# EasyEDA Pro project ProDoc_Sensor_2025-09-14.epro, schematic SS
Board Name: Sensor; Create Date: 2025-09-01; Page Name: P1; Project Name: ICM module; Schematic Name: Schematic3; Update Date: 2025-09-03; Company: EasyEDA.com; Page Size: A4; Version: V1.0
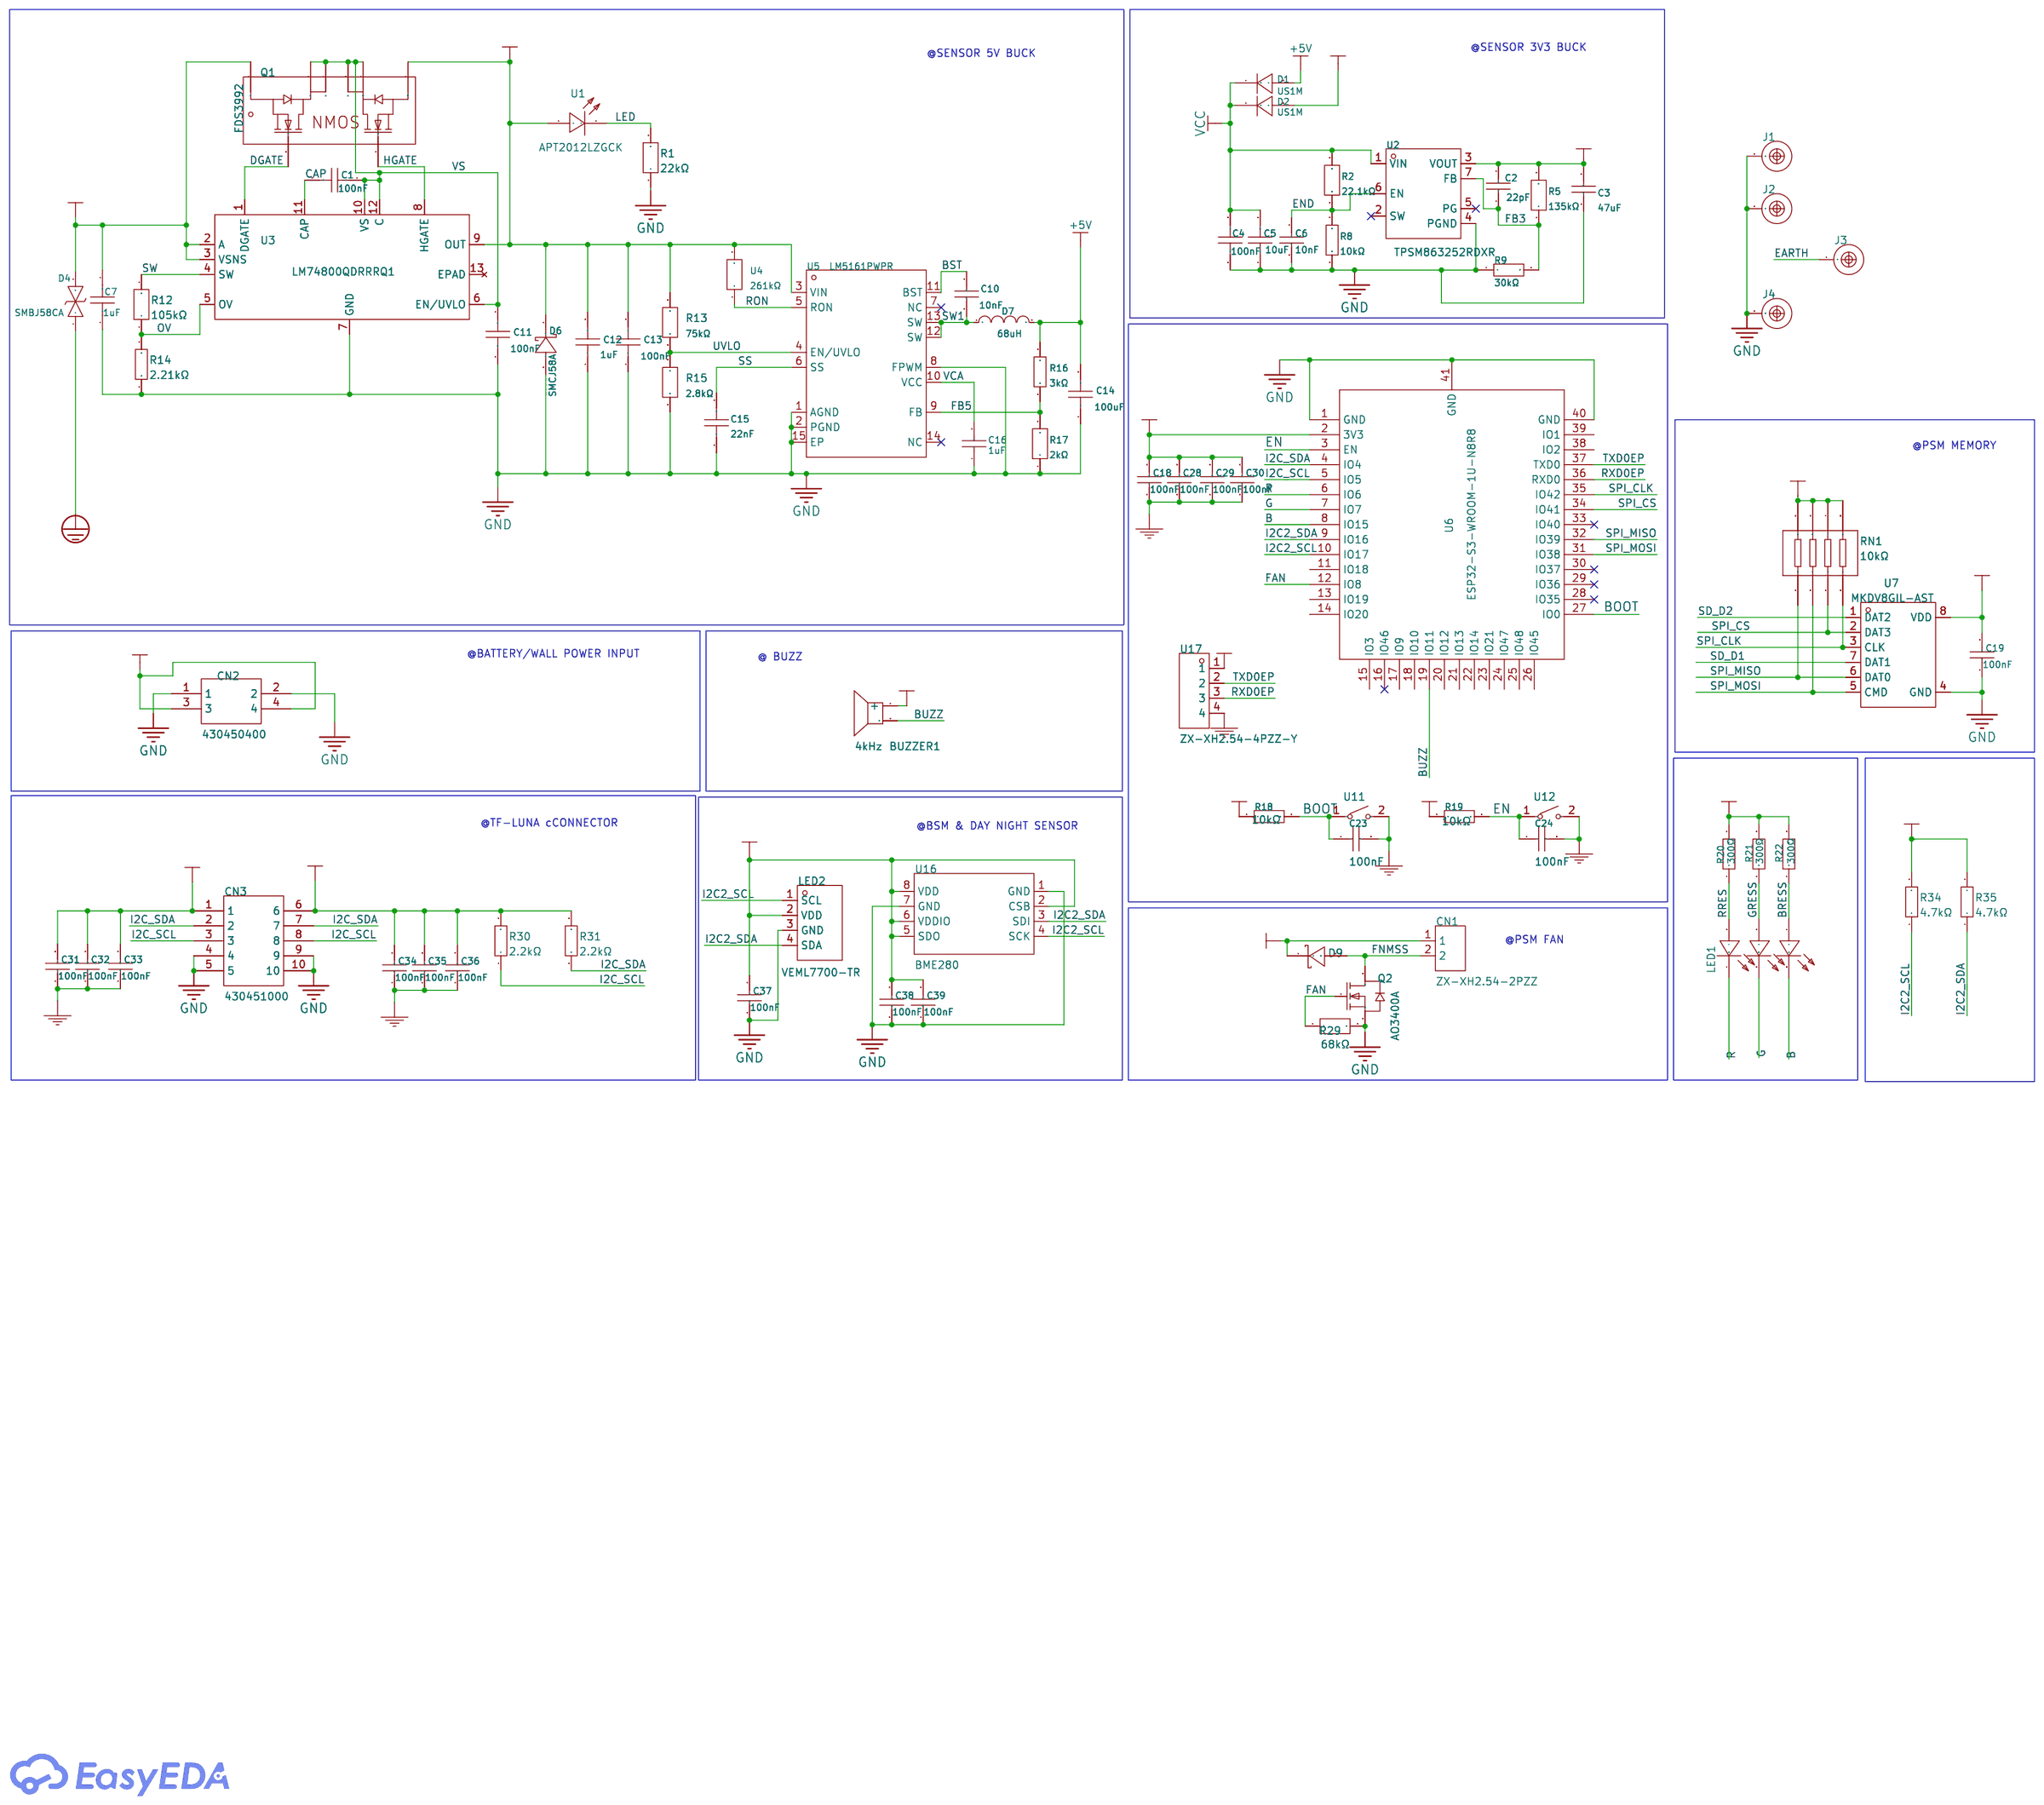
[diagram p0: schematic sheet]

## Parts
BUZZER1  4kHz  [BUZ-TH_PKM13EPYH4002-B0]
C1  100nF  [C1210]
C2  22pF  [C0201]
C3  47uF  [C1210]
C4  100nF  [C0402]
C5  10uF  [C0805]
C6  10nF  [C0201]
C7  1uF  [C2220]
C10  10nF  [C0402]
C11  100nF  [C1210]
C12  1uF  [C2220]
C13  100nF  [C1210]
C14  100uF  [C1210]
C15  22nF  [C0805]
C16  1uF  [C0603]
C18  100nF  [C0805]
C19  100nF  [C0805]
C23  100nF  [C0805]
C24  100nF  [C0805]
C28  100nF  [C0805]
C29  100nF  [C0805]
C30  100nF  [C0805]
C31  100nF  [C0805]
C32  100nF  [C0805]
C33  100nF  [C0805]
C34  100nF  [C0805]
C35  100nF  [C0805]
C36  100nF  [C0805]
C37  100nF  [C0805]
C38  100nF  [C0805]
C39  100nF  [C0805]
CN1  ZX-XH2.54-2PZZ  [CONN-TH_2P-P2.50_HX25003-2A]
CN2  430450400  [CONN-TH_0430450400]
CN3  430451000  [CONN-TH_43045-1000]
D1  US1M  [SMA_L4.4-W2.8-LS5.4-RD]
D2  US1M  [SMA_L4.4-W2.8-LS5.4-RD]
D4  SMBJ58CA  [SMB_L4.6-W3.6-LS5.3-BI]
D6  SMCJ58A  [SMC_L6.9-W5.8-LS7.9-RD]
D7  68uH  [IND-SMD_L12.5-W12.5-SRR1280-150M]
D9  BAT46WJ,115  [SOD-323F_L2.0-W1.6-LS2.5-RD]
J1  SCREW-MOUNTING-HOLE-3MM  [MountingHole:MountingHole_2.7mm_M2.5_Pad_Via]
J2  SCREW-MOUNTING-HOLE-3MM  [MountingHole:MountingHole_2.7mm_M2.5_Pad_Via]
J3  SCREW-MOUNTING-HOLE-3MM  [MountingHole:MountingHole_2.7mm_M2.5_Pad_Via]
J4  SCREW-MOUNTING-HOLE-3MM  [MountingHole:MountingHole_2.7mm_M2.5_Pad_Via]
LED1  HL-AF-5060H271BU46FU79GC-S1-THL  [LED-ARRAY-SMD_6P-L5.4-W5.0-TL-FD]
LED2  VEML7700-TR  [LED-SMD_4P-L6.8-W2.4_VEML7700-TR]
Q1  FDS3992  [SO-8_L4.9-W3.9-P1.27-LS5.9-BL]
Q2  AO3400A  [SOT-23-3_L2.9-W1.6-P1.90-LS2.8-BR]
R1  22kΩ  [R1210]
R2  22.1kΩ  [R0402]
R5  135kΩ  [R0603]
R8  10kΩ  [R0402]
R9  30kΩ  [R0603]
R12  105kΩ  [R1206]
R13  75kΩ  [R1210]
R14  2.21kΩ  [R1206]
R15  2.8kΩ  [R1210]
R16  3kΩ  [R0603]
R17  2kΩ  [R0402]
R18  10kΩ  [R0805]
R19  10kΩ  [R0805]
R20  300Ω  [R0805]
R21  300Ω  [R0805]
R22  300Ω  [R0805]
R29  68kΩ  [R1206]
R30  2.2kΩ  [R0805]
R31  2.2kΩ  [R0805]
R34  4.7kΩ  [R0805]
R35  4.7kΩ  [R0805]
RN1  10kΩ  [RES-ARRAY-SMD_0603-8P-L3.2-W1.6-BL]
U1  APT2012LZGCK  [LED-SMD_L2.0-W1.3-R-RD]
U2  TPSM863252RDXR  [QFN-7_L4.0-W3.3_TPSM863257RDXR]
U3  LM74800QDRRRQ1  [WSON-12_L3.0-W3.0-P0.50-TL-EP-2]
U4  261kΩ  [R0402]
U5  LM5161PWPR  [HTSSOP-14_L5.0-W4.4-P0.65-LS6.4-BL-EP3.0]
U6  ESP32-S3-WROOM-1U-N8R8  [WIRELM-SMD_ESP32-S3-WROOM-1U]
U7  MKDV8GIL-AST  [LGA-8_L6.0-W8.0-P1.27-TL]
U11  TD-1183SN-1.7H-250  [KEY-SMD_L3.0-W2.5-LS4.0]
U12  TD-1183SN-1.7H-250  [KEY-SMD_L3.0-W2.5-LS4.0]
U16  BME280  [LGA-8_BME280_BL]
U17  ZX-XH2.54-4PZZ-Y  [CONN-TH_4P-P2.50_ZX-XH2.54-4PZZ-Y]

## Library data of the parts
BUZZER1 = PKM13EPYH4002-B0: Driver Circuitry:Passive (external drive) Technology:Piezoelectric Voltage Rating:- Voltage - Supply:±15V Voltage - Supply:±15V Frequency:4kHz Current Consumption:- Sound Pressure Level(SPL):78dB Diameter(φD):12.6mm Length:- Width:- Height:7.4mm Operating; LCSC Part Name: 压电式蜂鸣器; Supplier Part: C128650; Manufacturer: muRata(村田); Supplier Footprint: 插件,D=12.6mm; JLCPCB Part Class: Extended Part; Datasheet: https://atta.szlcsc.com/upload/public/pdf/source/20200305/C492053_735FBBD713E87D0F645D81009B709975.pdf; Supplier: LCSC; Driver Circuitry: Passive (external drive); Technology: Piezoelectric; Voltage - Supply: ±15V; Sound Pressure Level(SPL): 78dB; Diameter(φD): 12.6mm; Height: 7.4mm; Operating Temperature: -40℃~+85℃
C1 C11 C13 = CC1210KKX7RYBB104: Capacitance: Tolerance:±10% Tolerance:±10% Voltage Rated: Temperature Coefficient:; LCSC Part Name: 100nF ±10% 250V; Supplier Part: C527381; Manufacturer: YAGEO(国巨); Supplier Footprint: 1210; JLCPCB Part Class: Extended Part; Datasheet: https://atta.szlcsc.com/upload/public/pdf/source/20200508/C527381_FB64CFF56C74B71B8CBBB2E2D2FF56B0.pdf; Supplier: LCSC; Tolerance: ±10%
C2 = GRM0335C1E220JA01D: Capacitance: Tolerance:±5% Tolerance:±5% Voltage Rated: Temperature Coefficient:; LCSC Part Name: 22pF ±5% 25V; Supplier Part: C76919; Manufacturer: muRata(村田); Supplier Footprint: 0201; JLCPCB Part Class: Extended Part; Datasheet: https://atta.szlcsc.com/upload/public/pdf/source/20180307/C76919_15204090858141407709.pdf; Supplier: LCSC; Tolerance: ±5%
C3 = GRM32ER71A476KE15L: Capacitance: Tolerance:±10% Tolerance:±10% Voltage Rated: Temperature Coefficient:; LCSC Part Name: 47uF ±10% 10V; Supplier Part: C84494; Manufacturer: muRata(村田); Supplier Footprint: 1210; JLCPCB Part Class: Extended Part; Datasheet: https://atta.szlcsc.com/upload/public/pdf/source/20161226/1482720144456.pdf; Supplier: LCSC; Tolerance: ±10%
C4 = GRM155R71A104KA01D: Capacitance: Tolerance:±10% Tolerance:±10% Voltage Rated: Temperature Coefficient:; LCSC Part Name: 100nF ±10% 10V; Supplier Part: C71687; Manufacturer: muRata(村田); Supplier Footprint: 0402; JLCPCB Part Class: Extended Part; Datasheet: https://atta.szlcsc.com/upload/public/pdf/source/20180228/C71687_15198055953951377607.pdf; Supplier: LCSC; Tolerance: ±10%
C5 = C0805C106K8PACTU: Capacitance: Tolerance:±10% Tolerance:±10% Voltage Rated: Temperature Coefficient:; LCSC Part Name: 10uF ±10% 10V; Supplier Part: C2167673; Manufacturer: KEMET(基美); Supplier Footprint: 0805; JLCPCB Part Class: Extended Part; Datasheet: https://atta.szlcsc.com/upload/public/pdf/source/20210601/F69F25D6FEA5EB3D7C122B835EA50B80.pdf; Supplier: LCSC; Tolerance: ±10%
C6 = GRM033R70J103KA01D: Capacitance: Tolerance:±10% Tolerance:±10% Voltage Rated: Temperature Coefficient:; LCSC Part Name: 10nF ±10% 6.3V; Supplier Part: C76940; Manufacturer: muRata(村田); Supplier Footprint: 0201; JLCPCB Part Class: Extended Part; Datasheet: https://atta.szlcsc.com/upload/public/pdf/source/20180307/C76940_15204091030811407728.pdf; Supplier: LCSC; Tolerance: ±10%
C7 C12 = GRM55DR72E105KW01L: Capacitance: Tolerance:±10% Tolerance:±10% Voltage Rated: Temperature Coefficient:; LCSC Part Name: 1uF ±10% 250V; Supplier Part: C489791; Manufacturer: muRata(村田); Supplier Footprint: 2220; JLCPCB Part Class: Extended Part; Datasheet: https://atta.szlcsc.com/upload/public/pdf/source/20200303/C489791_21819A01F8644F985297DAC22D62BF33.pdf; Supplier: LCSC; Tolerance: ±10%
C10 = GRM155R71H103KA88D: Capacitance: Tolerance:±10% Tolerance:±10% Voltage Rated: Temperature Coefficient:; LCSC Part Name: 10nF ±10% 50V; Supplier Part: C77019; Manufacturer: muRata(村田); Supplier Footprint: 0402; JLCPCB Part Class: Extended Part; Datasheet: https://atta.szlcsc.com/upload/public/pdf/source/20180326/C77019_6A3693CE1BCE757D6A8B7C99DAE1B441.pdf; Supplier: LCSC; Tolerance: ±10%
C14 = GRM32ER60J107ME20L_C88154: Capacitance: Tolerance:±20% Tolerance:±20% Voltage Rated: Temperature Coefficient:; LCSC Part Name: 100uF ±20% 6.3V; Supplier Part: C88154; Manufacturer: muRata(村田); Manufacturer Part: GRM32ER60J107ME20L; Supplier Footprint: 1210; JLCPCB Part Class: Extended Part; Datasheet: https://atta.szlcsc.com/upload/public/pdf/source/20170116/1484561244372.pdf; Supplier: LCSC; Tolerance: ±20%
C15 = CC0805KRX7R7BB223: Capacitance: Tolerance:±10% Tolerance:±10% Voltage Rated: Temperature Coefficient:; LCSC Part Name: 22nF ±10% 16V; Supplier Part: C519961; Manufacturer: YAGEO(国巨); Supplier Footprint: 0805; JLCPCB Part Class: Extended Part; Datasheet: https://atta.szlcsc.com/upload/public/pdf/source/20200423/C519961_BCF55CFF7AF7FA8FAC393D5C8451BEF7.pdf; Supplier: LCSC; Tolerance: ±10%
C16 = EMK107B7105KA-T: Capacitance:1uF Tolerance:±10% Tolerance:±10% Voltage Rating:16V Temperature Coefficient:X7R; LCSC Part Name: MSASE168SB7105KTNA01 1uF ±10% 16V; Supplier Part: C92759; Manufacturer: TAIYO YUDEN(太诱); Supplier Footprint: 0603; JLCPCB Part Class: Extended Part; Datasheet: https://item.szlcsc.com/datasheet/EMK107B7105KA-T/93953.html; Supplier: LCSC; Tolerance: ±10%; Voltage Rating: 16V; Temperature Coefficient: X7R
C18 C19 C23 C24 C28-C39 = 0805B104K500NT: Capacitance:100nF Tolerance:±10% Tolerance:±10% Voltage Rated: Temperature Coefficient:; LCSC Part Name: 100nF ±10% 50V; Supplier Part: C38141; Manufacturer: FH(风华); Supplier Footprint: 0805; JLCPCB Part Class: Extended Part; Datasheet: https://atta.szlcsc.com/upload/public/pdf/source/20200305/C486355_26A10D38EF8C2A5C37091D0039909270.pdf; Supplier: LCSC; Tolerance: ±10%
CN1 = ZX-XH2.54-2PZZ: Pins Structure:1x2P Pitch:2.5mm Mounting Type:Through Hole Reference Series:XH Number of Pins:2P Number of Rows:1 Number of PINs Per Row:2 Row Spacing:- Current Rating:3A Contact Material:Brass Contact Plating:Tin Operating Temperature:-25℃~+85℃ Operating; LCSC Part Name: 1x2P 间距:2.5mm 直插 系列:XH; Supplier Part: C7429632; Manufacturer: Megastar(兆星); Supplier Footprint: 插件,P=2.5mm; JLCPCB Part Class: Extended Part; Datasheet: https://item.szlcsc.com/datasheet/ZX-XH2.54-2PZZ/8427549.html; Supplier: LCSC; Pins Structure: 1x2P; Pitch: 2.5mm; Mounting Type: Through Hole; Reference Series: XH; Number of Pins: 2P; Number of Rows: 1; Number of PINs Per Row: 2; Current Rating: 3A; Contact Material: Brass; Contact Plating: Tin; Operating Temperature: -25℃~+85℃; Voltage Rating: 250V; Plastic Material: PA66; Flame Retardant Rating: UL94V-0; Color: White; Z-Height of the Board: 7mm; X-Length of Bottom Edge on Board (Spacing Line): 7.5mm; Y-Width of Bottom Edge on Board: 5.9mm
CN2 = 430450400_C122413: Pins Structure:2x2P Pitch:3mm Mounting Type:Right Angle Reference Series:Micro-Fit(MX 3.0) Number of Pins:4P Number of Rows:2 Number of PINs Per Row:2 Row Spacing:3mm Current Rating:8.5A Contact Material:Brass Contact Plating:Tin Operating Temperature:-40; LCSC Part Name: 2x2P 间距:3mm 弯插 系列:Micro-Fit(MX 3.0); Supplier Part: C122413; Manufacturer: MOLEX; Supplier Footprint: 弯插,P=3mm; JLCPCB Part Class: Extended Part; Datasheet: https://www.molex.com/content/dam/molex/molex-dot-com/products/automated/en-us/salesdrawingpdf/430/43045/430450400_sd.pdf?inline\; Supplier: LCSC; Pins Structure: 2x2P; Pitch: 3mm; Mounting Type: Right Angle; Reference Series: Micro-Fit(MX 3.0); Number of Pins: 4P; Number of Rows: 2; Number of PINs Per Row: 2; Row Spacing: 3mm; Current Rating: 8.5A; Contact Material: Brass; Contact Plating: Tin; Operating Temperature: -40℃~+105℃; Voltage Rating: 600V; Flame Retardant Rating: UL94V-0; Supplementary Features: Harpoon Contact (Plastic); Color: Black; Z-Height of the Board: 8.77mm; X-Length of Bottom Edge on Board (Spacing Line): 9.65mm; Y-Width of Bottom Edge on Board: 12.24mm
CN3 = 430451000: Pins Structure:2x5P Pitch:3mm Mounting Type:Right Angle Reference Series:Micro-Fit(MX 3.0) Number of Pins:10P Number of Rows:2 Number of PINs Per Row:5 Row Spacing:3mm Current Rating:8.5A Contact Material:Brass Contact Plating:Tin Operating Temperature:-4; LCSC Part Name: 2x5P 间距:3mm 弯插 系列:Micro-Fit(MX 3.0); Supplier Part: C122421; Manufacturer: MOLEX; Supplier Footprint: 弯插,P=3mm; JLCPCB Part Class: Extended Part; Datasheet: https://www.molex.com/content/dam/molex/molex-dot-com/products/automated/en-us/salesdrawingpdf/430/43045/430451000_sd.pdf?inline\; Supplier: LCSC; Pins Structure: 2x5P; Pitch: 3mm; Mounting Type: Right Angle; Reference Series: Micro-Fit(MX 3.0); Number of Pins: 10P; Number of Rows: 2; Number of PINs Per Row: 5; Row Spacing: 3mm; Current Rating: 8.5A; Contact Material: Brass; Contact Plating: Tin; Operating Temperature: -40℃~+105℃; Voltage Rating: 600V; Flame Retardant Rating: UL94V-0; Supplementary Features: Harpoon Contact (Plastic); Color: Black; Z-Height of the Board: 8.77mm; X-Length of Bottom Edge on Board (Spacing Line): 18.65mm; Y-Width of Bottom Edge on Board: 12.24mm
D1 D2 = US1M_C412437: Diode Configuration:Independent Type Forward Voltage (Vf@If):1.65V@1A Reverse Voltage (Vr): Rectified Current: Reverse Leakage Current:5uA@1kV Reverse Recovery Time (trr): Operating Temperature:-55℃~+150℃@(Tj) Operating Temperature:-55℃~+150℃@(Tj); LCSC Part Name: 电压:1kV 电流:1A; Supplier Part: C412437; Manufacturer: MDD(辰达半导体); Supplier Footprint: SMA; JLCPCB Part Class: Basic Part; Datasheet: https://atta.szlcsc.com/upload/public/pdf/source/20240710/67F2BD91F54C3EE0CEC9BDDD003BC3A0.pdf; Supplier: LCSC; Diode Configuration: Independent Type; Forward Voltage (Vf@If): 1.65V@1A; Reverse Leakage Current: 5uA@1kV; Operating Temperature: -55℃~+150℃@(Tj)
D4 = SMBJ58CA_C440309: Polarity:Bidirectional Reverse Stand-Off Voltage (Vrwm):58V Clamping Voltage:93.6V Peak Pulse Current (Ipp):6.4A Peak Pulse Power Dissipation (Ppp):600W@10/1000us Voltage - Breakdown:64.4V Reverse Leakage Current (Ir):5uA Operating Temperature:-55℃~+150℃; LCSC Part Name: 双向TVS 58V截止 峰值浪涌电流：6.4A; Supplier Part: C440309; Manufacturer: AnBon(安邦); Supplier Footprint: SMB(DO-214AA); JLCPCB Part Class: Extended Part; Datasheet: https://item.szlcsc.com/datasheet/SMBJ58CA/439717.html; Supplier: LCSC; Polarity: Bidirectional; Reverse Stand-Off Voltage (Vrwm): 58V; Clamping Voltage: 93.6V; Peak Pulse Current (Ipp): 6.4A; Peak Pulse Power Dissipation (Ppp): 600W@10/1000us; Voltage - Breakdown: 64.4V; Reverse Leakage Current (Ir): 5uA; Operating Temperature: -55℃~+150℃; Type: TVS
D6 = SMCJ58A_C42371547: Polarity:Unidirectional Reverse Stand-Off Voltage (Vrwm):58V Clamping Voltage:93.6V Peak Pulse Current (Ipp):16.1A Peak Pulse Power Dissipation (Ppp):1.5kW Voltage - Breakdown:71.2V Reverse Leakage Current (Ir):1uA Operating Temperature:-55℃~+150℃ Operati; LCSC Part Name: 1500W 表面贴装瞬态电压抑制器; Supplier Part: C42371547; Manufacturer: 宏嘉诚; Supplier Footprint: SMC(DO-214AB); JLCPCB Part Class: Extended Part; Datasheet: https://item.szlcsc.com/datasheet/SMCJ58A/44252474.html; Supplier: LCSC; Polarity: Unidirectional; Reverse Stand-Off Voltage (Vrwm): 58V; Clamping Voltage: 93.6V; Peak Pulse Current (Ipp): 16.1A; Peak Pulse Power Dissipation (Ppp): 1.5kW; Voltage - Breakdown: 71.2V; Reverse Leakage Current (Ir): 1uA; Operating Temperature: -55℃~+150℃; level of protection: IEC 61000-4-2; Type: TVS
D7 = SRR1260-680M: Inductance:68uH Tolerance:±20% Tolerance:±20% Current Rating:2.1A Current - Saturation(Isat):2.1A DC Resistance(DCR):110mΩ Type:- Ratings:-; LCSC Part Name: 68uH ±20% 2.1A; Supplier Part: C2041353; Manufacturer: BOURNS; Supplier Footprint: SMD,12.5x12.5mm; JLCPCB Part Class: Extended Part; Datasheet: https://item.szlcsc.com/datasheet/SRR1260-680M/2132916.html; Supplier: LCSC; Tolerance: ±20%; Current Rating: 2.1A; Current - Saturation(Isat): 2.1A; DC Resistance(DCR): 110mΩ
D9 = BAT46WJ,115: Forward Voltage (Vf@If):850mV@250mA Reverse Voltage (Vr):100V Average Rectified Current (Io):250mA Reverse Leakage Current (Ir):9uA@100V; LCSC Part Name: 电压:100V 电流:250mA; Supplier Part: C114696; Manufacturer: Nexperia(安世); Supplier Footprint: SOD-323F; JLCPCB Part Class: Extended Part; Datasheet: https://atta.szlcsc.com/upload/public/pdf/source/20170620/1497944776306.pdf; Supplier: LCSC; Forward Voltage (Vf@If): 850mV@250mA; Reverse Voltage (Vr): 100V; Average Rectified Current (Io): 250mA; Reverse Leakage Current (Ir): 9uA@100V
J1-J4 = SCREW-MOUNTING-HOLE-3MM
LED1 = HL-AF-5060H271BU46FU79GC-S1-THL: Supplier Part: C219409; Manufacturer: HONGLITRONIC(鸿利光电); Supplier Footprint: SMD5050; JLCPCB Part Class: Extended Part; Datasheet: https://atta.szlcsc.com/upload/public/pdf/source/20180503/C219409_0CFE42153F672A4C05B1C40D14E85291.pdf; Supplier: LCSC
LED2 = VEML7700-TR: Measurement Type:光强 Photoperceptivity:120klx Interface:I2C Resolution(Bits):16bit Voltage - Supply:2.5V~3.6V Voltage - Supply:2.5V~3.6V Operating Temperature:-25℃~+85℃ Operating Temperature:-25℃~+85℃; LCSC Part Name: I2C接口的高精度环境光传感器; Supplier Part: C504893; Manufacturer: VISHAY(威世); Supplier Footprint: SMD-4P; JLCPCB Part Class: Extended Part; Datasheet: https://atta.szlcsc.com/upload/public/pdf/source/20221116/DEE90B3A4BC655AA35A499F644213E9E.pdf; Supplier: LCSC; Measurement Type: 光强; Photoperceptivity: 120klx; Interface: I2C; Resolution(Bits): 16bit; Voltage - Supply: 2.5V~3.6V; Operating Temperature: -25℃~+85℃
Q1 = FDS3992: Number:2 N-Channel Drain to Source Voltage:100V Current - Continuous Drain(Id):4.5A RDS(on):- Pd - Power Dissipation:2.5W Gate Threshold Voltage (Vgs(th)):2V Gate Charge(Qg):11nC@10V Input Capacitance(Ciss):750pF@25V Reverse Transfer Capacitance (Crss@Vds; LCSC Part Name: 2个N沟道 耐压:100V 电流:4.5A; Supplier Part: C512899; Manufacturer: onsemi(安森美); Supplier Footprint: SO-8; JLCPCB Part Class: Extended Part; Datasheet: https://item.szlcsc.com/datasheet/FDS3992/527575.html; Supplier: LCSC; Number: 2 N-Channel; Drain to Source Voltage: 100V; Current - Continuous Drain(Id): 4.5A; Pd - Power Dissipation: 2.5W; Gate Threshold Voltage (Vgs(th)): 2V; Gate Charge(Qg): 11nC@10V; Input Capacitance(Ciss): 750pF@25V; Reverse Transfer Capacitance (Crss@Vds): 27pF@25V; Operating Temperature: -55℃~+150℃
Q2 = AO3400A_C5379092: Type:1 N-Channel Drain Source Voltage (Vdss): Continuous Drain Current (Id): Drain Source On Resistance (RDS(on)@Vgs,Id):20mΩ@10V,5A Power Dissipation (Pd): Gate Threshold Voltage (Vgs(th)@Id):1.2V@250uA Total Gate Charge (Qg@Vgs):4.1nC@10V Input Capacita; LCSC Part Name: 1个N沟道 耐压:30V 电流:5.8A; Supplier Part: C5379092; Manufacturer: MSKSEMI(美森科); Supplier Footprint: SOT-23-3L; JLCPCB Part Class: Extended Part; Datasheet: https://atta.szlcsc.com/upload/public/pdf/source/20241113/12FF27F8B99F921F6260393F7E001EE2.pdf; Supplier: LCSC; Type: 1 N-Channel; Drain Source On Resistance (RDS(on)@Vgs,Id): 20mΩ@10V,5A; Gate Threshold Voltage (Vgs(th)@Id): 1.2V@250uA; Total Gate Charge (Qg@Vgs): 4.1nC@10V; Input Capacitance (Ciss@Vds): 345pF@25V; Reverse Transfer Capacitance (Crss@Vds): 32pF@25V; Operating Temperature: -55℃~+150℃
R1 = AC1210FR-0722KL: Type:Thick Film Resistor Resistance:22kΩ Tolerance:±1% Tolerance:±1% Power(Watts):500mW Voltage-Supply(Max):200V Temperature Coefficient:±100ppm/℃ Temperature Coefficient:±100ppm/℃ Operating Temperature:-55℃~+155℃ Operating Temperature:-55℃~+155℃; LCSC Part Name: 厚膜电阻 22kΩ ±1% 500mW; Supplier Part: C230119; Manufacturer: YAGEO(国巨); Supplier Footprint: 1210; JLCPCB Part Class: Extended Part; Datasheet: https://atta.szlcsc.com/upload/public/pdf/source/20241120/4D446B3946E6DC27047BD586A1D384B4.pdf; Supplier: LCSC; Type: Thick Film Resistor; Tolerance: ±1%; Power(Watts): 500mW; Voltage-Supply(Max): 200V; Temperature Coefficient: ±100ppm/℃; Operating Temperature: -55℃~+155℃
R2 = CRCW040222K1FKED: Type:Thick Film Resistors Resistance:22.1kΩ Tolerance:±1% Tolerance:±1% Power(Watts):62.5mW Voltage-Supply(Max):50V Temperature Coefficient:±100ppm/℃ Temperature Coefficient:±100ppm/℃ Operating Temperature:-55℃~+155℃ Operating Temperature:-55℃~+155℃; LCSC Part Name: 厚膜电阻 22.1kΩ ±1% 62.5mW; Supplier Part: C844504; Manufacturer: VISHAY(威世); Supplier Footprint: 0402; JLCPCB Part Class: Extended Part; Datasheet: https://atta.szlcsc.com/upload/public/pdf/source/20200927/C844919_23E7F5DF28E9421F105631C5C2D28736.pdf; Supplier: LCSC; Type: Thick Film Resistors; Tolerance: ±1%; Power(Watts): 62.5mW; Voltage-Supply(Max): 50V; Temperature Coefficient: ±100ppm/℃; Operating Temperature: -55℃~+155℃
R5 = RT0603BRD07135KL: Type:Thin Film Resistor Resistance: Tolerance:±0.1% Tolerance:±0.1% Power(Watts): Temperature Coefficient:±25ppm/℃ Temperature Coefficient:±25ppm/℃ Operating Temperature Range:-55℃~+155℃ Operating Temperature Range:-55℃~+155℃; LCSC Part Name: 薄膜电阻 135kΩ ±0.1% 100mW; Supplier Part: C861113; Manufacturer: YAGEO(国巨); Supplier Footprint: 0603; JLCPCB Part Class: Extended Part; Datasheet: https://atta.szlcsc.com/upload/public/pdf/source/20200610/C326738_5639A9F1B6EB6E4AE2197577D3456E7F.pdf; Supplier: LCSC; Type: Thin Film Resistor; Tolerance: ±0.1%; Temperature Coefficient: ±25ppm/℃; Operating Temperature Range: -55℃~+155℃
R8 = CRCW040210K0FKED: Type:Thick Film Resistors Resistance:10kΩ Tolerance:±1% Tolerance:±1% Power(Watts):63mW Voltage-Supply(Max):50V Temperature Coefficient:±100ppm/℃ Temperature Coefficient:±100ppm/℃ Operating Temperature:-55℃~+155℃ Operating Temperature:-55℃~+155℃; LCSC Part Name: 厚膜电阻 10kΩ ±1% 63mW; Supplier Part: C71617; Manufacturer: VISHAY(威世); Supplier Footprint: 0402; JLCPCB Part Class: Extended Part; Datasheet: https://atta.szlcsc.com/upload/public/pdf/source/20180420/C190124_A776A444B598E5893D919B5902899056.pdf; Supplier: LCSC; Type: Thick Film Resistors; Tolerance: ±1%; Power(Watts): 63mW; Voltage-Supply(Max): 50V; Temperature Coefficient: ±100ppm/℃; Operating Temperature: -55℃~+155℃
R9 = RC0603FR-0730KL: Type:Thick Film Resistor Resistance:30kΩ Tolerance:±1% Tolerance:±1% Power(Watts):100mW Voltage-Supply(Max):75V Temperature Coefficient:±100ppm/℃ Temperature Coefficient:±100ppm/℃ Operating Temperature:-55℃~+155℃ Operating Temperature:-55℃~+155℃; LCSC Part Name: 厚膜电阻 30kΩ ±1% 100mW; Supplier Part: C100001; Manufacturer: YAGEO(国巨); Supplier Footprint: 0603; JLCPCB Part Class: Extended Part; Datasheet: https://atta.szlcsc.com/upload/public/pdf/source/20250610/89E4D743C004A82A45145C7A2CC3A578.pdf; Supplier: LCSC; Type: Thick Film Resistor; Tolerance: ±1%; Power(Watts): 100mW; Voltage-Supply(Max): 75V; Temperature Coefficient: ±100ppm/℃; Operating Temperature: -55℃~+155℃
R12 = RC1206FR-07105KL: Type:Thick Film Resistor Resistance:105kΩ Tolerance:±1% Tolerance:±1% Power(Watts):250mW Voltage-Supply(Max):200V Temperature Coefficient:±100ppm/℃ Temperature Coefficient:±100ppm/℃ Operating Temperature:-55℃~+155℃ Operating Temperature:-55℃~+155℃; LCSC Part Name: 厚膜电阻 105kΩ ±1% 250mW; Supplier Part: C488616; Manufacturer: YAGEO(国巨); Supplier Footprint: 1206; JLCPCB Part Class: Extended Part; Datasheet: https://atta.szlcsc.com/upload/public/pdf/source/20250610/89E4D743C004A82A45145C7A2CC3A578.pdf; Supplier: LCSC; Type: Thick Film Resistor; Tolerance: ±1%; Power(Watts): 250mW; Voltage-Supply(Max): 200V; Temperature Coefficient: ±100ppm/℃; Operating Temperature: -55℃~+155℃
R13 = AC1210FR-0775KL: Type:Thick Film Resistors Resistance: Tolerance:±1% Tolerance:±1% Power(Watts): Overload Voltage (Max): Temperature Coefficient:±100ppm/℃ Temperature Coefficient:±100ppm/℃ Operating Temperature Range:-55℃~+155℃ Operating Temperature Range:-55℃~+155℃; LCSC Part Name: 厚膜电阻 75kΩ ±1% 500mW; Supplier Part: C230340; Manufacturer: YAGEO(国巨); Supplier Footprint: 1210; JLCPCB Part Class: Extended Part; Datasheet: https://atta.szlcsc.com/upload/public/pdf/source/20191108/C230504_7FB43CAE7E86B3B2980C2491161B254C.pdf; Supplier: LCSC; Type: Thick Film Resistors; Tolerance: ±1%; Temperature Coefficient: ±100ppm/℃; Operating Temperature Range: -55℃~+155℃
R14 = AC1206FR-072K21L: Type:Thick Film Resistors Resistance: Tolerance:±1% Tolerance:±1% Power(Watts):250mW Overload Voltage (Max): Temperature Coefficient:±100ppm/℃ Temperature Coefficient:±100ppm/℃ Operating Temperature Range:-55℃~+155℃ Operating Temperature Range:-55℃~+155℃; LCSC Part Name: 厚膜电阻 2.21kΩ ±1% 250mW; Supplier Part: C229508; Manufacturer: YAGEO(国巨); Supplier Footprint: 1206; JLCPCB Part Class: Extended Part; Datasheet: https://atta.szlcsc.com/upload/public/pdf/source/20180927/C229861_4ABDC471507C1ED6AFB4BA66AFC8620A.pdf; Supplier: LCSC; Type: Thick Film Resistors; Tolerance: ±1%; Power(Watts): 250mW; Temperature Coefficient: ±100ppm/℃; Operating Temperature Range: -55℃~+155℃
R15 = AC1210FR-072K8L: Type:Thick Film Resistors Resistance: Tolerance:±1% Tolerance:±1% Power(Watts): Overload Voltage (Max): Temperature Coefficient:±100ppm/℃ Temperature Coefficient:±100ppm/℃ Operating Temperature Range:-55℃~+155℃ Operating Temperature Range:-55℃~+155℃; LCSC Part Name: 厚膜电阻 2.8kΩ ±1% 500mW; Supplier Part: C230171; Manufacturer: YAGEO(国巨); Supplier Footprint: 1210; JLCPCB Part Class: Extended Part; Datasheet: https://atta.szlcsc.com/upload/public/pdf/source/20191108/C230504_7FB43CAE7E86B3B2980C2491161B254C.pdf; Supplier: LCSC; Type: Thick Film Resistors; Tolerance: ±1%; Temperature Coefficient: ±100ppm/℃; Operating Temperature Range: -55℃~+155℃
R16 = RC0603FR-073KL: Type:Thick Film Resistors Resistance:3kΩ Tolerance:±1% Tolerance:±1% Power(Watts):100mW Voltage-Supply(Max):75V Temperature Coefficient:±100ppm/℃ Temperature Coefficient:±100ppm/℃ Operating Temperature:-55℃~+155℃ Operating Temperature:-55℃~+155℃; LCSC Part Name: 厚膜电阻 3kΩ ±1% 100mW; Supplier Part: C126358; Manufacturer: YAGEO(国巨); Supplier Footprint: 0603; JLCPCB Part Class: Extended Part; Datasheet: https://atta.szlcsc.com/upload/public/pdf/source/20170914/C127450_1505359406912967677.pdf; Supplier: LCSC; Type: Thick Film Resistors; Tolerance: ±1%; Power(Watts): 100mW; Voltage-Supply(Max): 75V; Temperature Coefficient: ±100ppm/℃; Operating Temperature: -55℃~+155℃
R17 = CRCW04022K00FKED: Type:Thick Film Resistors Resistance: Tolerance:±1% Tolerance:±1% Power(Watts): Overload Voltage (Max): Temperature Coefficient:±100ppm/℃ Temperature Coefficient:±100ppm/℃ Operating Temperature Range:-55℃~+155℃ Operating Temperature Range:-55℃~+155℃; LCSC Part Name: 厚膜电阻 2kΩ ±1% 62.5mW; Supplier Part: C482125; Manufacturer: VISHAY(威世); Supplier Footprint: 0402; JLCPCB Part Class: Extended Part; Datasheet: https://atta.szlcsc.com/upload/public/pdf/source/20200618/C481956_E25174B008CE8C884BEDD7D4D15E674F.pdf; Supplier: LCSC; Type: Thick Film Resistors; Tolerance: ±1%; Temperature Coefficient: ±100ppm/℃; Operating Temperature Range: -55℃~+155℃
R18 R19 = 0805W8F1002T5E: Type:Thick Film Resistors Resistance:10kΩ Tolerance:±1% Tolerance:±1% Power(Watts): Overload Voltage (Max): Temperature Coefficient:±100ppm/℃ Temperature Coefficient:±100ppm/℃ Operating Temperature Range:-55℃~+155℃ Operating Temperature Range:-55℃~+155℃; LCSC Part Name: 10kΩ ±1% 125mW 厚膜电阻; Supplier Part: C17414; Manufacturer: UNI-ROYAL(厚声); Supplier Footprint: 0805; JLCPCB Part Class: Basic Part; Datasheet: https://atta.szlcsc.com/upload/public/pdf/source/20200306/C422600_1E6D84923E4A46A82E41ADD87F860B5C.pdf; Supplier: LCSC; Type: Thick Film Resistors; Tolerance: ±1%; Temperature Coefficient: ±100ppm/℃; Operating Temperature Range: -55℃~+155℃
R20-R22 = 0805W8F3000T5E: Type:Thick Film Resistor Resistance:300Ω Tolerance:±1% Tolerance:±1% Power(Watts):125mW Voltage-Supply(Max):150V Temperature Coefficient:±100ppm/℃ Temperature Coefficient:±100ppm/℃ Operating Temperature:-55℃~+155℃ Operating Temperature:-55℃~+155℃; LCSC Part Name: 300Ω ±1% 125mW 厚膜电阻; Supplier Part: C17617; Manufacturer: UNI-ROYAL(厚声); Supplier Footprint: 0805; JLCPCB Part Class: Basic Part; Datasheet: https://item.szlcsc.com/datasheet/0805W8F3000T5E/18305.html; Supplier: LCSC; Type: Thick Film Resistor; Tolerance: ±1%; Power(Watts): 125mW; Voltage-Supply(Max): 150V; Temperature Coefficient: ±100ppm/℃; Operating Temperature: -55℃~+155℃
R29 = RT1206BRD0768KL: Type:Thin Film Resistor Resistance: Tolerance:±0.1% Tolerance:±0.1% Power(Watts):250mW Overload Voltage (Max): Temperature Coefficient:±25ppm/℃ Temperature Coefficient:±25ppm/℃ Operating Temperature Range:-55℃~+155℃ Operating Temperature Range:-55℃~+155℃; LCSC Part Name: 薄膜电阻 68kΩ ±0.1% 250mW; Supplier Part: C706422; Manufacturer: YAGEO(国巨); Supplier Footprint: 1206; JLCPCB Part Class: Extended Part; Datasheet: https://atta.szlcsc.com/upload/public/pdf/source/20200720/C706422_759B829B0D18A4900E8B43DA140C33CB.pdf; Supplier: LCSC; Type: Thin Film Resistor; Tolerance: ±0.1%; Power(Watts): 250mW; Temperature Coefficient: ±25ppm/℃; Operating Temperature Range: -55℃~+155℃
R30 R31 = 0805W8F2201T5E_C17520: Type:Thick Film Resistors Resistance:2.2kΩ Tolerance:±1% Tolerance:±1% Power(Watts): Overload Voltage (Max): Temperature Coefficient:±100ppm/℃ Temperature Coefficient:±100ppm/℃ Operating Temperature Range:-55℃~+155℃ Operating Temperature Range:-55℃~+155℃; LCSC Part Name: 2.2kΩ ±1% 125mW 厚膜电阻; Supplier Part: C17520; Manufacturer: UNI-ROYAL(厚声); Manufacturer Part: 0805W8F2201T5E; Supplier Footprint: 0805; JLCPCB Part Class: Basic Part; Datasheet: https://atta.szlcsc.com/upload/public/pdf/source/20200306/C422600_1E6D84923E4A46A82E41ADD87F860B5C.pdf; Supplier: LCSC; Type: Thick Film Resistors; Tolerance: ±1%; Temperature Coefficient: ±100ppm/℃; Operating Temperature Range: -55℃~+155℃
R34 R35 = 0805W8F4701T5E: Type:Thick Film Resistors Resistance:4.7kΩ Tolerance:±1% Tolerance:±1% Power(Watts): Overload Voltage (Max): Temperature Coefficient:±100ppm/℃ Temperature Coefficient:±100ppm/℃ Operating Temperature Range:-55℃~+155℃ Operating Temperature Range:-55℃~+155℃; LCSC Part Name: 4.7kΩ ±1% 125mW 厚膜电阻; Supplier Part: C17673; Manufacturer: UNI-ROYAL(厚声); Supplier Footprint: 0805; JLCPCB Part Class: Basic Part; Datasheet: https://atta.szlcsc.com/upload/public/pdf/source/20200306/C422600_1E6D84923E4A46A82E41ADD87F860B5C.pdf; Supplier: LCSC; Type: Thick Film Resistors; Tolerance: ±1%; Temperature Coefficient: ±100ppm/℃; Operating Temperature Range: -55℃~+155℃
RN1 = 4D03WGJ0103T5E: Number of Resistors: Resistance:10kΩ Tolerance:±5% Tolerance:±5% Power(Watts): Temperature Coefficient:±200ppm/℃ Temperature Coefficient:±200ppm/℃ Number of Pins:; LCSC Part Name: 10kΩ ±5%; Supplier Part: C29718; Manufacturer: UNI-ROYAL(厚声); Supplier Footprint: 0603x4; JLCPCB Part Class: Basic Part; Datasheet: https://atta.szlcsc.com/upload/public/pdf/source/20191224/C474318_2527498AE30E813171187CCD28401A71.pdf; Supplier: LCSC; Tolerance: ±5%; Temperature Coefficient: ±200ppm/℃
U1 = APT2012LZGCK: Illumination Color:Emerald Green Voltage - Forward(Vf):2.65V Voltage - Forward(Vf):2.65V Forward Current:2mA Wavelength - Dominant:525nm Wavelength - Dominant:525nm Peak Wavelength:515nm Lens Color:Water Clear Luminous Intensity:50mcd Luminous Intensity:5; Supplier Part: C5569446; Manufacturer: Kingbright; Supplier Footprint: 0805; JLCPCB Part Class: Extended Part; Datasheet: https://item.szlcsc.com/datasheet/APT2012LZGCK/6487820.html; Supplier: LCSC; Illumination Color: Emerald Green; Voltage - Forward(Vf): 2.65V; Forward Current: 2mA; Wavelength - Dominant: 525nm; Peak Wavelength: 515nm; Lens Color: Water Clear; Luminous Intensity: 50mcd
U2 = TPSM863252RDXR: Function:Buck Number of Outputs:1 Voltage - Supply:3V~17V Voltage - Supply:3V~17V Output Voltage Accuracy:±1.5% Output Voltage Accuracy:±1.5% Output Voltage:600mV~10V Output Voltage:600mV~10V Output Current(Max):3A Output Current(Max):3A Supply Current (I; Supplier Part: C19632640; Manufacturer: TI(德州仪器); Supplier Footprint: QFN-FCMOD-7(3.3x4); JLCPCB Part Class: Extended Part; Datasheet: https://www.ti.com.cn/cn/lit/ds/symlink/tpsm863252.pdf?ts=1738739465848&ref_url=https%253A%252F%252Fwww.ti.com.cn%252Fsitesearch%252Fzh-cn%252Fdocs%252Funiversalsearch.tsp%253FlangPref%253Dzh-CN%2526nr%253D12%2526searchTerm%253DTPSM863252RDXR; Supplier: LCSC; Function: Buck; Number of Outputs: 1; Voltage - Supply: 3V~17V; Output Voltage Accuracy: ±1.5%; Output Voltage: 600mV~10V; Output Current(Max): 3A; Supply Current (Iq): 100uA; Switching Frequency: 1.2MHz; Ripple Noise: 20mVp-p; Features: Over Current Protection；Over Voltage Protection；Under Voltage Protection；Over Temperature Protection; Length: 4mm; Width: 3.3mm; Height: 2mm; Operating Temperature Range: -40℃~+125℃
U3 = LM74800QDRRRQ1: Maximum Continuous Current:2.6A Voltage - Supply:3V~65V Voltage - Supply:3V~65V Operating Temperature	-:-40℃~+125℃ Operating Temperature	-:-40℃~+125℃; Supplier Part: C3215600; Manufacturer: TI(德州仪器); Supplier Footprint: SON-12(3x3); JLCPCB Part Class: Extended Part; Datasheet: https://www.ti.com/cn/lit/gpn/lm7480-q1; Supplier: LCSC; Maximum Continuous Current: 2.6A; Voltage - Supply: 3V~65V; Operating Temperature	-: -40℃~+125℃
U4 = CRCW0402261KFKED: Type:Thick Film Resistors Resistance: Tolerance:±1% Tolerance:±1% Power(Watts): Overload Voltage (Max): Temperature Coefficient:±100ppm/℃ Temperature Coefficient:±100ppm/℃ Operating Temperature:-55℃~+155℃ Operating Temperature:-55℃~+155℃; LCSC Part Name: 厚膜电阻 261kΩ ±1% 62.5mW; Supplier Part: C2076807; Manufacturer: VISHAY(威世); Supplier Footprint: 0402; JLCPCB Part Class: Extended Part; Datasheet: https://atta.szlcsc.com/upload/public/pdf/source/20210503/4CAD3FA9B4C9A749933C1C52DBF827C2.pdf; Supplier: LCSC; Type: Thick Film Resistors; Tolerance: ±1%; Temperature Coefficient: ±100ppm/℃; Operating Temperature: -55℃~+155℃
U5 = LM5161PWPR: Function:Step-down type Output Type:Adjustable Input Voltage:4.5V~100V Input Voltage:4.5V~100V Output Voltage:2V~92V Output Voltage:2V~92V Output Current:1A Switching Frequency:1MHz Switching Frequency:1MHz Operating Temperature:-40℃~+125℃@(TJ) Operating; LCSC Part Name: 100V 1A 同步降压转换器; Supplier Part: C468246; Manufacturer: TI(德州仪器); Supplier Footprint: HTSSOP-14-EP; JLCPCB Part Class: Extended Part; Datasheet: https://www.ti.com/cn/lit/gpn/lm5161; Supplier: LCSC; Function: Step-down type; Output Type: Adjustable; Input Voltage: 4.5V~100V; Output Voltage: 2V~92V; Output Current: 1A; Switching Frequency: 1MHz; Operating Temperature: -40℃~+125℃@(TJ); Synchronous Rectification: Yes; Number of Outputs: 1; Topology: Step-down；Flyback; Switch tube (built-in/external): Built-in
U6 = ESP32-S3-WROOM-1U-N8R8: LCSC Part Name: 通用型Wi-Fi+低功耗蓝牙MCU模组; Supplier Part: C2980300; Manufacturer: ESPRESSIF(乐鑫); Supplier Footprint: SMD,18x19.2mm; JLCPCB Part Class: Extended Part; Datasheet: https://item.szlcsc.com/datasheet/ESP32-S3-WROOM-1U-N8R8/3401552.html; Supplier: LCSC
U7 = MKDV8GIL-AST: Memory Size:8Gbit Clock Frequency:50MHz Voltage - Supply:2.7V~3.6V Voltage - Supply:2.7V~3.6V Write Cycle Time(tWC):- Page Program time (TPP):- Block Erase Time(tBE):- Data Retention - TDR (Year):- Operating Temperature:-40℃~+85℃ Operating Temperature:-40; LCSC Part Name: 8Gb SD NAND  SDNAND工业级宽温 SLC; Supplier Part: C26159627; Manufacturer: MK(米客方德); Supplier Footprint: LGA-8(6x8); JLCPCB Part Class: Extended Part; Datasheet: https://atta.szlcsc.com/upload/public/pdf/source/20240705/6522E9CE94E018BF06A2CACAEEC15C56.pdf; Supplier: LCSC; Memory Size: 8Gbit; Clock Frequency: 50MHz; Voltage - Supply: 2.7V~3.6V; Operating Temperature: -40℃~+85℃; Interface: SD2.0
U11 U12 = TD-1183SN-1.7H-250: LCSC Part Name: 小型正按轻触开关无柱 250gf H1.8; Supplier Part: C2905195; Manufacturer: DEALON(德艺隆); Supplier Footprint: SMD,2.5x3mm; JLCPCB Part Class: Extended Part; Datasheet: https://atta.szlcsc.com/upload/public/pdf/source/20220901/31B45DB5661394D4632E3F23E0E23353.pdf; Supplier: LCSC
U16 = BME280: Voltage - Supply:1.71V~3.6V Voltage - Supply:1.71V~3.6V; LCSC Part Name: 湿度：0%RH~100%RH; Supplier Part: C92489; Manufacturer: Bosch(博世); Supplier Footprint: LGA-8(2.5x2.5); JLCPCB Part Class: Extended Part; Datasheet: https://atta.szlcsc.com/upload/public/pdf/source/20230217/9358ECB1DA7C52D8F39392648E599102.pdf; Supplier: LCSC; Voltage - Supply: 1.71V~3.6V
U17 = ZX-XH2.54-4PZZ-Y: Pins Structure:1x4P Pitch:2.5mm Mounting Type:Through Hole Reference Series:XH Number of Pins:4P Number of Rows:1 Number of PINs Per Row:4 Row Spacing:- Current Rating:3A Contact Material:Copper Alloy Contact Plating:Tin Operating Temperature:-25℃~+85℃ Op; LCSC Part Name: 1x4P 间距:2.5mm 直插 系列:XH; Supplier Part: C22388686; Manufacturer: Megastar(兆星); Supplier Footprint: 插件,P=2.5mm; JLCPCB Part Class: Extended Part; Datasheet: https://item.szlcsc.com/datasheet/ZX-XH2.54-4PZZ-Y/23957034.html; Supplier: LCSC; Pins Structure: 1x4P; Pitch: 2.5mm; Mounting Type: Through Hole; Reference Series: XH; Number of Pins: 4P; Number of Rows: 1; Number of PINs Per Row: 4; Current Rating: 3A; Contact Material: Copper Alloy; Contact Plating: Tin; Operating Temperature: -25℃~+85℃; Voltage Rating: 250V; Plastic Material: PA66; Color: Yellow; Z-Height of the Board: 7mm; X-Length of Bottom Edge on Board (Spacing Line): 12.5mm; Y-Width of Bottom Edge on Board: 5.9mm

## Nets
+3V3: BUZZER1.1(+) C2.2 C3.2 C18.2 C19.2 C28.2 C29.2 C30.2 C31.2 C32.2 C33.2 C34.2 C35.2 C36.2 C37.2 C38.2 C39.2 CN3.1 CN3.6 LED2.2(VDD) R5.2 R18.1 R19.1 R20.2 R21.2 R22.2 R30.2 R31.2 R34.2 R35.2 RN1.5 RN1.6 RN1.7 RN1.8 U2.3(VOUT) U6.2(3V3) U7.8(VDD) U16.2(CSB) U16.5(SDO) U16.6(VDDIO) U16.8(VDD) U17.1
+5V: C14.2 D1.2(A) D7.2 R16.2
+48V: C12.2 C13.2 D6.1(K) Q1.3(S2) R13.2 U1.1(A) U3.9(OUT) U4.2 U5.3(VIN)
GND: C3.1 C4.1 C5.1 C6.1 C7.2 C11.1 C12.1 C13.1 C14.1 C15.1 C16.1 C18.1 C19.1 C23.2 C24.2 C28.1 C29.1 C30.1 C31.1 C32.1 C33.1 C34.1 C35.1 C36.1 C37.1 C38.1 C39.1 CN2.1 CN2.2 CN3.4 CN3.5 CN3.9 CN3.10 D6.2(A) J1.1 J2.1 J4.1 LED2.3(GND) Q2.2(S) R1.1 R8.1 R9.1 R14.1 R15.1 R17.1 R29.2 U2.4(PGND) U3.7(GND) U5.1(AGND) U5.2(PGND) U5.8(FPWM) U5.15(EP) U6.1(GND) U6.40(GND) U6.41(GND) U7.4(GND) U11.2 U12.2 U16.1(GND) U16.7(GND) U17.4
VBUS: D2.2(A)
VCC: C4.2 C5.2 D1.1(C) D2.1(C) R2.2 U2.1(VIN)
VIN: C7.1 CN1.1 CN2.3 CN2.4 D4.2 D9.1(K) Q1.1(S1) U3.2(A) U3.3(VSNS)
B: LED1.6(C) U6.8(IO15)
BOOT: C23.1 R18.2 U6.27(IO0) U11.1
BRESS: LED1.1(A) R22.1
BST: C10.2 U5.11(BST)
BUZZ: BUZZER1.2 U6.19(IO11)
CAP: C1.2 U3.11(CAP)
DGATE: Q1.2(G1) U3.1(DGATE)
EARTH: D4.1 J3.1
EN: C24.1 R19.2 U6.3(EN) U12.1
END: C6.2 R2.1 R8.2 U2.6(EN)
FAN: Q2.1(G) R29.1 U6.12(IO8)
FB3: C2.1 R5.1 R9.2 U2.7(FB)
FB5: R16.1 R17.2 U5.9(FB)
FNMSS: CN1.2 D9.2(A) Q2.3(D)
G: LED1.5(C) U6.7(IO7)
GRESS: LED1.2(A) R21.1
HGATE: Q1.4(G2) U3.8(HGATE)
I2C2_SCL: LED2.1(SCL) R34.1 U6.10(IO17) U16.4(SCK)
I2C2_SDA: LED2.4(SDA) R35.1 U6.9(IO16) U16.3(SDI)
I2C_SCL: CN3.3 CN3.8 R30.1 U6.5(IO5)
I2C_SDA: CN3.2 CN3.7 R31.1 U6.4(IO4)
LED: R1.2 U1.2(K)
OV: R12.1 R14.2 U3.5(OV)
R: LED1.4(C) U6.6(IO6)
RON: U4.1 U5.5(RON)
RRES: LED1.3(A) R20.1
RXD0EP: U6.36(RXD0) U17.3
SD_D1: U7.7(DAT1)
SD_D2: U7.1(DAT2)
SPI_CLK: RN1.1 U6.35(IO42) U7.3(CLK)
SPI_CS: RN1.2 U6.34(IO41) U7.2(DAT3)
SPI_MISO: RN1.4 U6.32(IO39) U7.6(DAT0)
SPI_MOSI: RN1.3 U6.31(IO38) U7.5(CMD)
SS: C15.2 U5.6(SS)
SW: R12.2 U3.4(SW)
SW1: C10.1 D7.1 U5.12(SW) U5.13(SW)
TXD0EP: U6.37(TXD0) U17.2
UVLO: R13.1 R15.2 U5.4(EN/UVLO)
VCA: C16.2 U5.10(VCC)
VS: C1.1 C11.2 Q1.5(D2) Q1.6(D2) Q1.7(D1) Q1.8(D1) U3.6(EN/UVLO) U3.10(VS) U3.12(C)

Not connected (* = marked no-connect by the designer): U2 2(SW)* 5(PG)*; U3 13(EPAD); U5 7(NC)* 14(NC)*; U6 11(IO18) 13(IO19) 14(IO20) 15(IO3) 16(IO46)* 17(IO9) 18(IO10) 20(IO12) 21(IO13) 22(IO14) 23(IO21) 24(IO47) 25(IO48) 26(IO45) 28(IO35)* 29(IO36)* 30(IO37)* 33(IO40)* 38(IO2) 39(IO1)

## Notes on the sheet
- @SENSOR 3V3 BUCK
- @SENSOR 5V BUCK
- @PSM MEMORY
- @BATTERY/WALL POWER INPUT
- @ BUZZ
- @TF-LUNA cCONNECTOR
- @BSM & DAY NIGHT SENSOR
- @PSM FAN
